# EAGLE design G8MainA (99,5x31) (EAGLE 9.0.0)

## Sheet 1 of 2
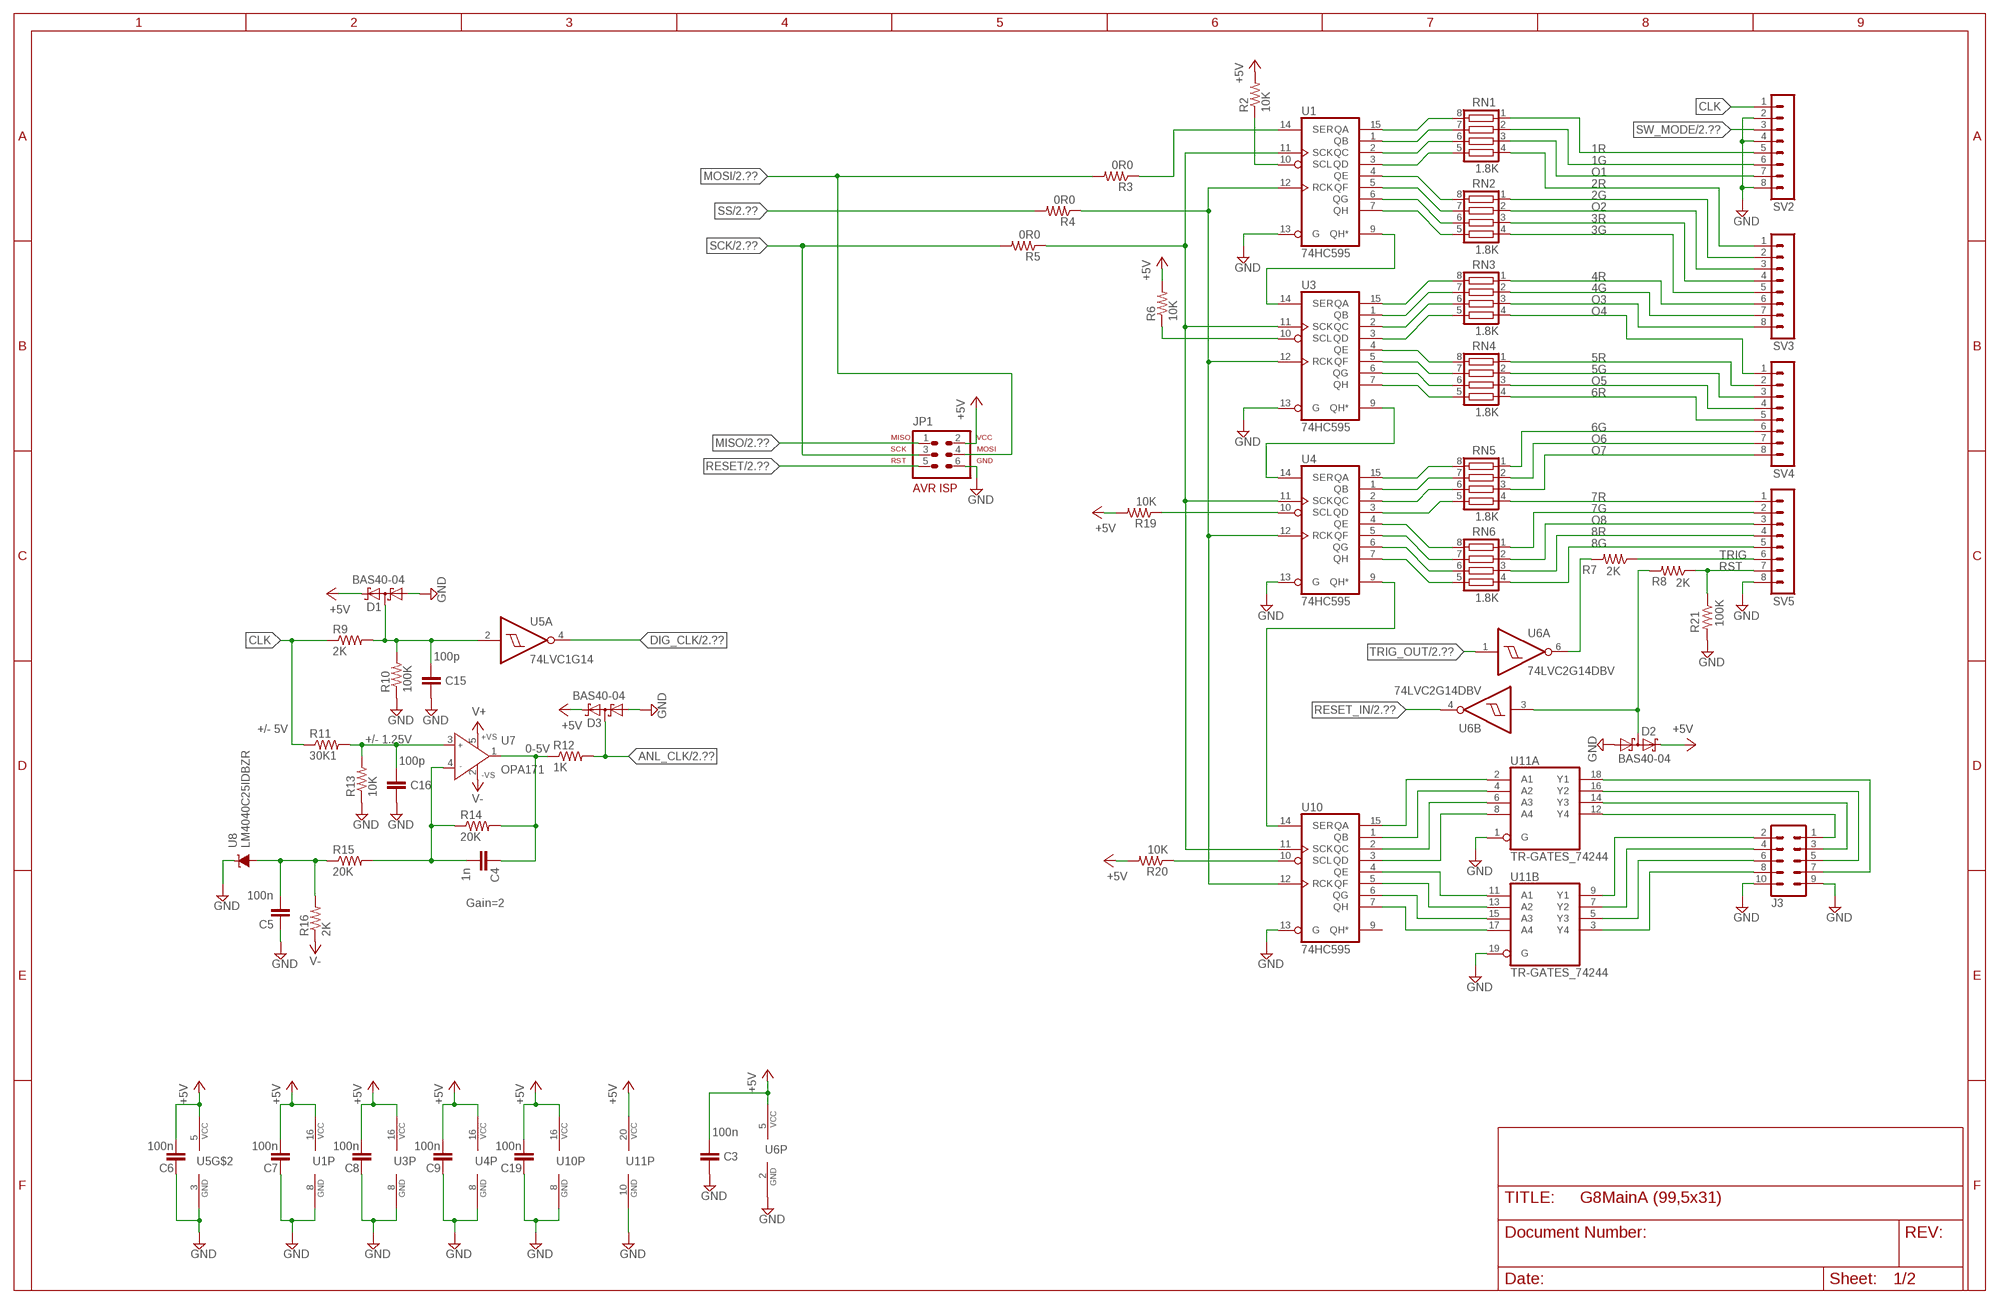
[diagram p0: schematic, sheet 1]

### Parts
C3  100n  C0603  [C0603]
C4  1n  C0603  [C0603]
C5  100n  C0603  [C0603]
C6  100n  C0603  [C0603]
C7  100n  C0603  [C0603]
C8  100n  C0603  [C0603]
C9  100n  C0603  [C0603]
C15  100p  C0603  [C0603]
C16  100p  C0603  [C0603]
C19  100n  C0603  [C0603]
D1  BAS40-04  [SOT23]
D2  BAS40-04  [SOT23]
D3  BAS40-04  [SOT23]
J3  MA05-2  [MA05-2]
JP1  AVR-ISP-6VERT  [AVR-ISP-6]
R2  10K  R0603  [R0603]
R3  0R0  R0603  [R0603]
R4  0R0  R0603  [R0603]
R5  0R0  R0603  [R0603]
R6  10K  R0603  [R0603]
R7  2K  R0603  [R0603]
R8  2K  R0603  [R0603]
R9  2K  R0603  [R0603]
R10  100K  R0603  [R0603]
R11  30K1  R0603  [R0603]
R12  1K  R0603  [R0603]
R13  10K  R0603  [R0603]
R14  20K  R0603  [R0603]
R15  20K  R0603  [R0603]
R16  2K  R0603  [R0603]
R19  10K  R0603  [R0603]
R20  10K  R0603  [R0603]
R21  100K  R0603  [R0603]
RN1  1.8K  CTS742C083  [CTS742C083]
RN2  1.8K  CTS742C083  [CTS742C083]
RN3  1.8K  CTS742C083  [CTS742C083]
RN4  1.8K  CTS742C083  [CTS742C083]
RN5  1.8K  CTS742C083  [CTS742C083]
RN6  1.8K  CTS742C083  [CTS742C083]
SV2  MA08-1-O  [MA08-OCT]
SV3  MA08-1-O  [MA08-OCT]
SV4  MA08-1-O  [MA08-OCT]
SV5  MA08-1-O  [MA08-OCT]
U1  74HC595  74595DT  [TSSOP16]
U3  74HC595  74595DT  [TSSOP16]
U4  74HC595  74595DT  [TSSOP16]
U5  74LVC1G14  [SOT23-5L]
U6  74LVC2G14DBV  [SOT23-6]
U7  OPA171  AD8031RJ  [SOT23-5]
U8  LM4040C25IDBZR  LM4041A12DBZ  [DBZ_R-PDSO-G3]
U10  74HC595  74595DT  [TSSOP16]
U11  TR-GATES_74244  [TR-GATES_TSSOP20]

### Nets
+5V: C3.2 C6.2 C7.2 C8.2 C9.2 C19.2 D1.2(C2) D2.2(C2) D3.2(C2) JP1.2 R2.2 R6.2 R19.2 R20.2 U1.16(VCC) U3.16(VCC) U4.16(VCC) U5.5(VCC) U6.5(P:VCC) U10.16(VCC) U11.20(P:VCC) ; also sheet 2
ANL_CLK: D3.3(C1A2) R12.2 ; also sheet 2
CLK: R9.1 R11.1 SV2.1
DIG_CLK: U5.4(A:O) ; also sheet 2
GND: C3.1 C5.1 C6.1 C7.1 C8.1 C9.1 C15.1 C16.1 C19.1 D1.1(A1) D2.1(A1) D3.1(A1) J3.9 J3.10 JP1.6 R10.1 R13.1 R21.2 SV2.2 SV2.4 SV2.8 SV5.8 U1.8(GND) U1.13(G) U3.8(GND) U3.13(G) U4.8(GND) U4.13(G) U5.3(GND) U6.2(P:GND) U8.1(C) U10.8(GND) U10.13(G) U11.1(A:G) U11.10(P:GND) U11.19(B:G) ; also sheet 2
MISO: JP1.1 ; also sheet 2
MOSI: JP1.4 R3.2 ; also sheet 2
N$1: U1.9(QH*) U3.14(SER)
N$2: C15.2 D1.3(C1A2) R9.2 R10.2 U5.2(A:I)
N$3: C16.2 R11.2 R13.2 U7.3(IN+)
N$4: C4.2 R14.1 R15.2 U7.4(IN-)
N$5: U3.9(QH*) U4.14(SER)
N$7: R5.1 U1.11(SCK) U3.11(SCK) U4.11(SCK) U10.11(SCK)
N$8: R4.1 U1.12(RCK) U3.12(RCK) U4.12(RCK) U10.12(RCK)
N$9: R6.1 U3.10(SCL)
N$12: RN3.8 U3.15(QA)
N$13: RN2.8 U1.4(QE)
N$14: RN2.7 U1.5(QF)
N$15: RN2.6 U1.6(QG)
N$16: RN2.5 U1.7(QH)
N$17: RN1.5 U1.3(QD)
N$18: RN1.6 U1.2(QC)
N$19: C4.1 R12.1 R14.2 U7.1(OUT)
N$20: RN1.7 U1.1(QB)
N$21: RN1.8 U1.15(QA)
N$22: R3.1 U1.14(SER)
N$25: RN3.7 U3.1(QB)
N$26: RN3.6 U3.2(QC)
N$27: RN3.5 U3.3(QD)
N$28: RN4.8 U3.4(QE)
N$29: RN4.7 U3.5(QF)
N$30: RN4.6 U3.6(QG)
N$31: RN4.5 U3.7(QH)
N$32: RN5.8 U4.15(QA)
N$33: RN5.7 U4.1(QB)
N$34: RN5.6 U4.2(QC)
N$35: RN5.5 U4.3(QD)
N$36: RN6.8 U4.4(QE)
N$37: RN6.7 U4.5(QF)
N$38: RN6.6 U4.6(QG)
N$39: RN6.5 U4.7(QH)
N$40: RN1.1 SV2.5
N$41: RN1.2 SV2.6
N$42: RN1.3 SV2.7
N$43: RN1.4 SV3.1
N$44: RN2.1 SV3.2
N$45: RN2.2 SV3.3
N$46: RN2.3 SV3.4
N$47: RN2.4 SV3.5
N$48: RN3.1 SV3.6
N$49: RN3.2 SV3.7
N$50: RN3.3 SV3.8
N$51: RN3.4 SV4.1
N$52: RN4.1 SV4.2
N$53: RN4.2 SV4.3
N$54: RN4.3 SV4.4
N$55: RN4.4 SV4.5
N$56: RN5.1 SV4.6
N$57: RN5.2 SV4.7
N$58: RN5.3 SV4.8
N$59: RN5.4 SV5.1
N$60: RN6.1 SV5.2
N$61: RN6.2 SV5.3
N$62: RN6.3 SV5.4
N$63: RN6.4 SV5.5
N$68: R19.1 U4.10(SCL)
N$69: R2.1 U1.10(SCL)
N$70: C5.2 R15.1 R16.2 U8.2(A)
N$72: R8.1 R21.1 SV5.7
N$73: R7.1 SV5.6
N$74: R7.2 U6.6(A:O)
N$76: D2.3(C1A2) R8.2 U6.3(B:I)
N$77: U4.9(QH*) U10.14(SER)
N$78: R20.1 U10.10(SCL)
N$79: J3.7 U11.18(A:Y1)
N$80: U10.15(QA) U11.2(A:A1)
N$81: U10.1(QB) U11.4(A:A2)
N$82: U10.2(QC) U11.6(A:A3)
N$83: U10.3(QD) U11.8(A:A4)
N$84: U10.4(QE) U11.11(B:A1)
N$85: U10.5(QF) U11.13(B:A2)
N$86: U10.6(QG) U11.15(B:A3)
N$87: U10.7(QH) U11.17(B:A4)
N$88: J3.5 U11.16(A:Y2)
N$89: J3.3 U11.14(A:Y3)
N$90: J3.1 U11.12(A:Y4)
N$91: J3.2 U11.9(B:Y1)
N$92: J3.4 U11.7(B:Y2)
N$93: J3.6 U11.5(B:Y3)
N$94: J3.8 U11.3(B:Y4)
RESET: JP1.5 ; also sheet 2
RESET_IN: U6.4(B:O) ; also sheet 2
SCK: JP1.3 R5.2 ; also sheet 2
SS: R4.2 ; also sheet 2
SW_MODE: SV2.3 ; also sheet 2
TRIG_OUT: U6.1(A:I) ; also sheet 2
V+: U7.5(+VS) ; also sheet 2
V-: R16.1 U7.2(-VS) ; also sheet 2
Unconnected: U10.9(QH*)

### Notes on the sheet
- 1R
- 1G
- O1
- 2R
- 2G
- O2
- 3R
- 3G
- 4R
- 4G
- O3
- O4
- 5R
- 5G
- O5
- 6R
- 6G
- O6
- O7
- 7R
- 7G
- O8
- 8R
- 8G
- TRIG
- RST
- +/- 5V
- +/- 1.25V
- 0-5V
- Gain=2

## Sheet 2 of 2
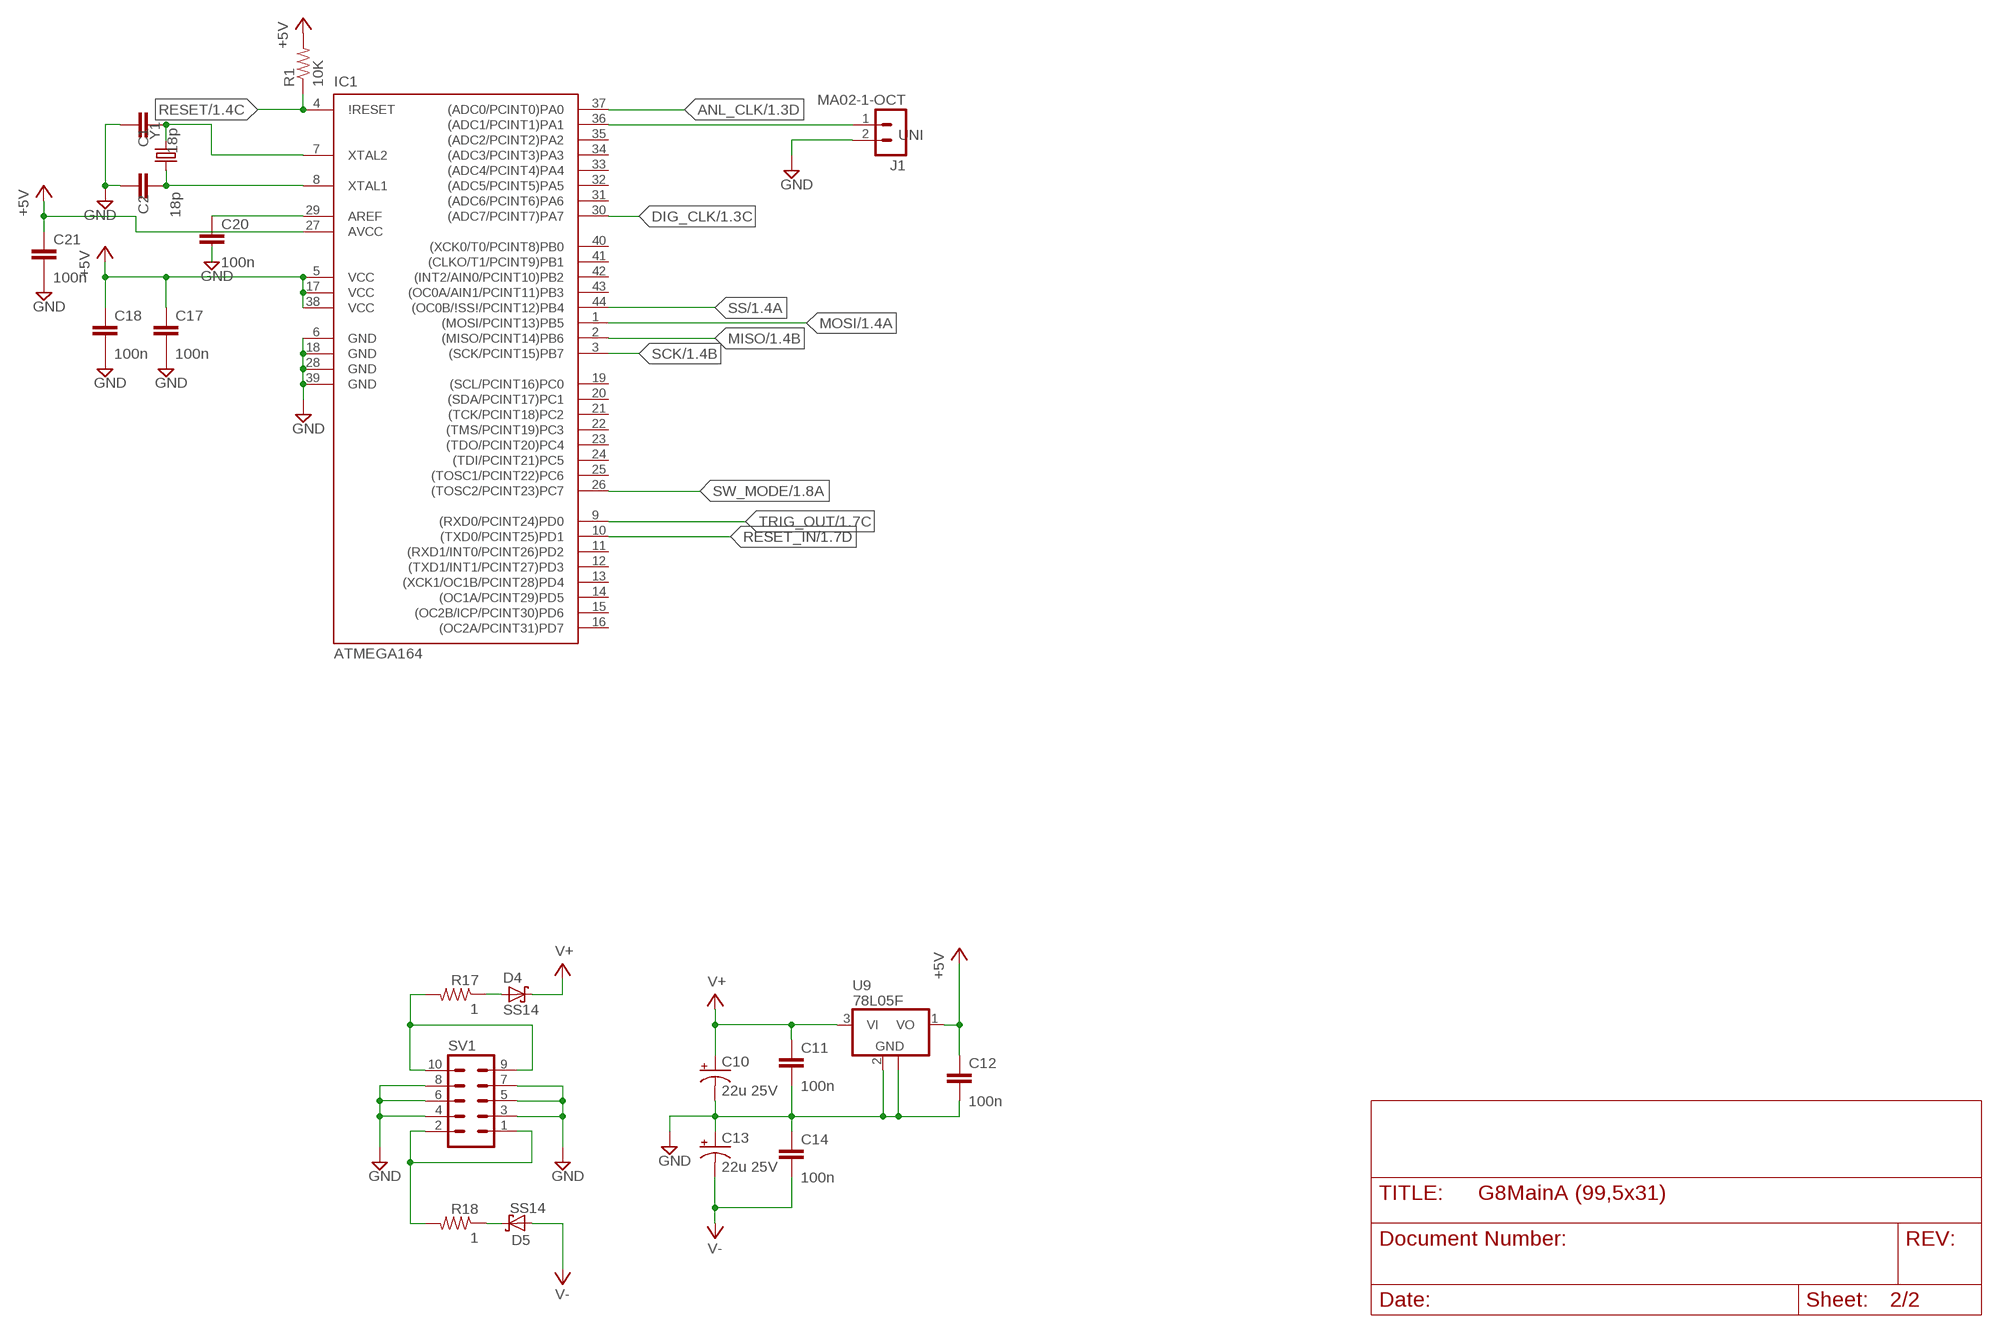
[diagram p1: schematic, sheet 2]

### Parts
C1  18p  C0603  [C0603]
C2  18p  C0603  [C0603]
C10  22u 25V  CPOL-USC  [PANASONIC_C]
C11  100n  C0603  [C0603]
C12  100n  C0603  [C0603]
C13  22u 25V  CPOL-USC  [PANASONIC_C]
C14  100n  C0603  [C0603]
C17  100n  C0603  [C0603]
C18  100n  C0603  [C0603]
C20  100n  C0603  [C0603]
C21  100n  C0603  [C0603]
D4  SS14  T100331  [SMA-DO214AC]
D5  SS14  T100331  [SMA-DO214AC]
IC1  ATMEGA164  MEGA164P/324P/644P-AU  [TQFP44]
J1  MA02-1-OCT  [MA02-1-OCT]
R1  10K  R0603  [R0603]
R17  1  R0603  [R0603]
R18  1  R0603  [R0603]
SV1  MA05-2  [MA05-2]
U9  78L05F  [SOT89]
Y1  CRYSTALHC49UV  [HC49U-V]

### Nets
+5V: C12.1 C17.1 C18.1 C21.1 IC1.5(VCC) IC1.17(VCC) IC1.27(AVCC) IC1.38(VCC) R1.2 U9.1(VO) ; also sheet 1
ANL_CLK: IC1.37((ADC0/PCINT0)PA0) ; also sheet 1
DIG_CLK: IC1.30((ADC7/PCINT7)PA7) ; also sheet 1
GND: C1.1 C2.1 C10.- C11.2 C12.2 C13.+ C14.1 C17.2 C18.2 C20.2 C21.2 IC1.6(GND) IC1.18(GND) IC1.28(GND) IC1.39(GND) J1.2 SV1.3 SV1.4 SV1.5 SV1.6 SV1.7 SV1.8 U9.2(GND) U9.2@1(GND) ; also sheet 1
MISO: IC1.2((MISO/PCINT14)PB6) ; also sheet 1
MOSI: IC1.1((MOSI/PCINT13)PB5) ; also sheet 1
N$6: C20.1 IC1.29(AREF)
N$10: C2.2 IC1.8(XTAL1) Y1.1
N$11: C1.2 IC1.7(XTAL2) Y1.2
N$24: IC1.36((ADC1/PCINT1)PA1) J1.1
N$64: R18.2 SV1.1 SV1.2
N$65: D4.A R17.1
N$66: R17.2 SV1.9 SV1.10
N$67: D5.K(C) R18.1
RESET: IC1.4(\!RESET) R1.1 ; also sheet 1
RESET_IN: IC1.10((TXD0/PCINT25)PD1) ; also sheet 1
SCK: IC1.3((SCK/PCINT15)PB7) ; also sheet 1
SS: IC1.44((OC0B/\!SS\!/PCINT12)PB4) ; also sheet 1
SW_MODE: IC1.26((TOSC2/PCINT23)PC7) ; also sheet 1
TRIG_OUT: IC1.9((RXD0/PCINT24)PD0) ; also sheet 1
V+: C10.+ C11.1 D4.K(C) U9.3(VI) ; also sheet 1
V-: C13.- C14.2 D5.A ; also sheet 1
Unconnected: IC1.11((RXD1/INT0/PCINT26)PD2) IC1.12((TXD1/INT1/PCINT27)PD3) IC1.13((XCK1/OC1B/PCINT28)PD4) IC1.14((OC1A/PCINT29)PD5) IC1.15((OC2B/ICP/PCINT30)PD6) IC1.16((OC2A/PCINT31)PD7) IC1.19((SCL/PCINT16)PC0) IC1.20((SDA/PCINT17)PC1) IC1.21((TCK/PCINT18)PC2) IC1.22((TMS/PCINT19)PC3) IC1.23((TDO/PCINT20)PC4) IC1.24((TDI/PCINT21)PC5) IC1.25((TOSC1/PCINT22)PC6) IC1.31((ADC6/PCINT6)PA6) IC1.32((ADC5/PCINT5)PA5) IC1.33((ADC4/PCINT4)PA4) IC1.34((ADC3/PCINT3)PA3) IC1.35((ADC2/PCINT2)PA2) IC1.40((XCK0/T0/PCINT8)PB0) IC1.41((CLKO/T1/PCINT9)PB1) IC1.42((INT2/AIN0/PCINT10)PB2) IC1.43((OC0A/AIN1/PCINT11)PB3)

### Notes on the sheet
- UNI

## Library data of the parts
C1-C9 C11 C12 C14-C21 = tr-passives:C0603
C10 C13 = rcl:CPOL-US: POLARIZED CAPACITOR, American symbol; DK: PCE3900CT-ND; SPICEPREFIX: C
D1-D3 = diode:BAS40-04: Silicon Schottky Diodes General-purpose diode for high-speed switching
D4 D5 = CA Diodes:T100331: SS14 Schottky diode; CA: T100331
IC1 = avr-5-4.16:MEGA164P/324P/644P-AU
J1 = tr-con:MA02-1
J3 SV1 = tr-con:MA05-2: PIN HEADER
JP1 = avr-7:AVR-ISP-6: AVR ISP-6 Serial Programming Header
R1-R21 = tr-passives:R0603
RN1-RN6 = resistor-net:CTS742C083: Chip Resistor Array 4 Single Resistor Source: http://www.ctscorp.com/components/Datasheets/CTSChipArrayDs.pdf; OC_FARNELL: unknown; OC_NEWARK: unknown
SV2-SV5 = tr-con:MA08-1: PIN HEADER
U1 U3 U4 U10 = tr-gates:74*595: 8-bit SHIFT REGISTER, output latch
U5 = tr-gates:74LVC1G14
U6 = tr-gates:74LVC2G14
U7 = analog-devices:AD8031: 2.7 V, 800 ?A, 80 MHz Rail-to-Rail I/O Amplifiers Source: http://www.analog.com/static/imported-files/data_sheets/AD8031_8032.pdf; MPN: AD8031ARTZ-REEL7; OC_FARNELL: 1660972; OC_NEWARK: 84R8399
U8 = texas:LM4041: PRECISION MICROPOWER SHUNT VOLTAGE REFERENCE Source: http://focus.ti.com/lit/ds/slcs146e/slcs146e.pdf; MPN: LM4041A12IDBZR; OC_FARNELL: 1407949; OC_NEWARK: 58K5875
U9 = tr-ps:78L*: POSITOIV-VOLTAGE REGULATORS Output up to 100 mA Source: http://focus.ti.com/lit/ds/symlink/ua78l05.pdf
U11 = !74LS244:TR-GATES_74*244: Octal BUFFER and LINE DRIVER, 3-state
Y1 = SparkFun-FreqCtrl:CRYSTAL: Various standard crystals. Proven footprints. Spark Fun Electronics SKU : COM-00534

## Board
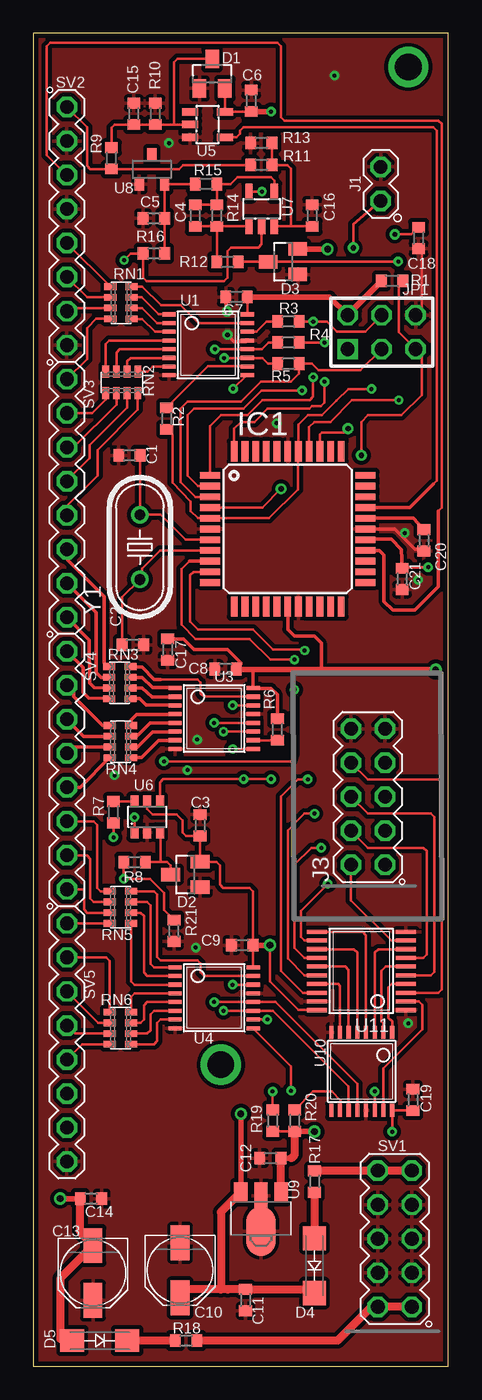
[diagram p2: board, top side]
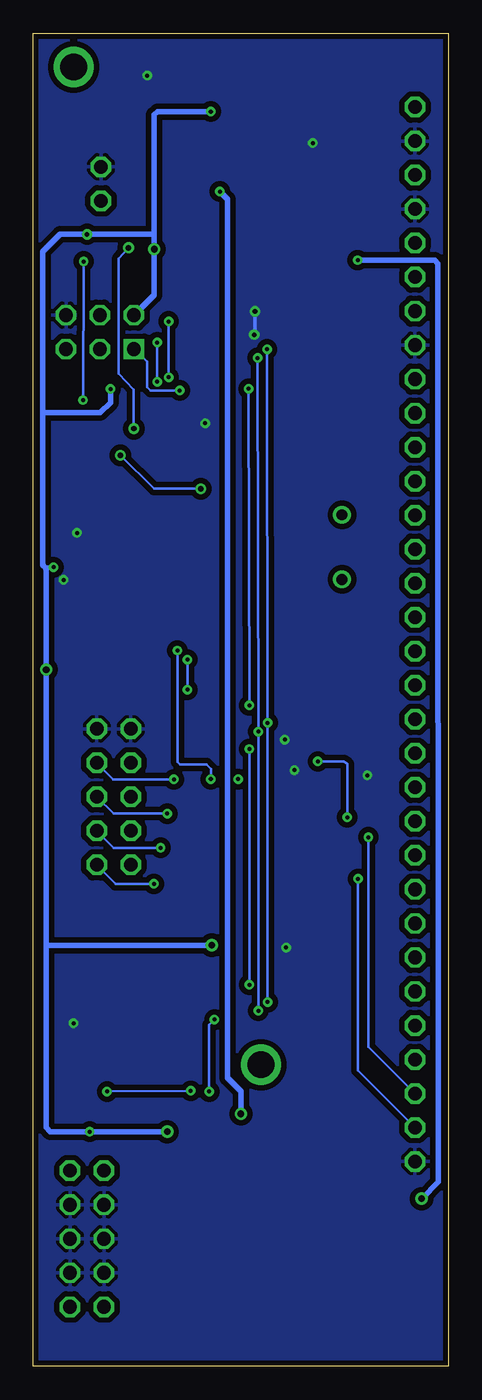
[diagram p3: board, bottom side, seen from below]

Size 31 x 99.5 mm. Coordinates in mm from the lower left corner, seen from the top.
Outline: 0,0 31,0 31,99.5 0,99.5 0,0
Copper layers (1*16): Top 0.035mm / dielectric 1.5mm / Bottom 0.035mm
Design rules "default *": minimum track width 6mil, minimum drill 0.3mm, track to track 6mil, track to pad 6mil, pad to pad 6mil, via to via 6mil, smd to smd 6mil, copper to edge 15mil, drill to drill 6mil, minimum pad ring 10mil, minimum via ring 8mil, stop-mask expansion 4mil, vias tented up to drill 0mil, thermal gap 10mil

### Footprints (pad centres in the part's own frame; a part is rotated, then mirrored left to right if it is on the bottom)
C0603 = smd 0.8 x 0.95: 1 -0.8,0; 2 0.8,0
PANASONIC_C = smd 2.6 x 1.4: + 2.05,0; - -2.05,0
SOT23 = smd 1 x 1.4: 1 -0.95,-1.1; 2 0.95,-1.1; 3 0,1.1
SMA-DO214AC = smd 1.8 x 1.7: A -2.05,0; K 2.05,0
TQFP44 = smd 1.5 x 0.5: 1 -5.8,4; 2 -5.8,3.2; 3 -5.8,2.4; 4 -5.8,1.6; 5 -5.8,0.8; 6 -5.8,0; 7 -5.8,-0.8; 8 -5.8,-1.6; 9 -5.8,-2.4; 10 -5.8,-3.2; 11 -5.8,-4; 23 5.8,-4; 24 5.8,-3.2; 25 5.8,-2.4; 26 5.8,-1.6; 27 5.8,-0.8; 28 5.8,0; 29 5.8,0.8; 30 5.8,1.6; 31 5.8,2.4; 32 5.8,3.2; 33 5.8,4 | smd 0.5 x 1.5: 12 -4,-5.8; 13 -3.2,-5.8; 14 -2.4,-5.8; 15 -1.6,-5.8; 16 -0.8,-5.8; 17 0,-5.8; 18 0.8,-5.8; 19 1.6,-5.8; 20 2.4,-5.8; 21 3.2,-5.8; 22 4,-5.8; 34 4,5.8; 35 3.2,5.8; 36 2.4,5.8; 37 1.6,5.8; 38 0.8,5.8; 39 0,5.8; 40 -0.8,5.8; 41 -1.6,5.8; 42 -2.4,5.8; 43 -3.2,5.8; 44 -4,5.8
MA02-1-OCT = drill 1.016 octagon: 1 -1.27,0; 2 1.27,0
MA05-2 = drill 1.016 octagon: 1 -5.08,-1.27; 2 -5.08,1.27; 3 -2.54,-1.27; 4 -2.54,1.27; 5 0,-1.27; 6 0,1.27; 7 2.54,-1.27; 8 2.54,1.27; 9 5.08,-1.27; 10 5.08,1.27
AVR-ISP-6 = drill 1.016 square: 1 -2.54,-1.27 | drill 1.016 octagon: 2 -2.54,1.27; 3 0,-1.27; 4 0,1.27; 5 2.54,-1.27; 6 2.54,1.27
R0603 = smd 0.8 x 0.95: 1 -0.8,0; 2 0.8,0
CTS742C083 = smd 0.5 x 0.9: 1 -1.2,-0.8; 2 -0.4,-0.8; 3 0.4,-0.8; 4 1.2,-0.8; 5 1.2,0.8; 6 0.4,0.8; 7 -0.4,0.8; 8 -1.2,0.8
MA08-OCT = drill 1.016 octagon: 1 -8.89,0; 2 -6.35,0; 3 -3.81,0; 4 -1.27,0; 5 1.27,0; 6 3.81,0; 7 6.35,0; 8 8.89,0
TSSOP16 = smd 0.305 x 0.991: 1 -2.275,-2.918; 2 -1.625,-2.918; 3 -0.975,-2.918; 4 -0.325,-2.918; 5 0.325,-2.918; 6 0.975,-2.918; 7 1.625,-2.918; 8 2.275,-2.918; 9 2.275,2.918; 10 1.625,2.918; 11 0.975,2.918; 12 0.325,2.918; 13 -0.325,2.918; 14 -0.975,2.918; 15 -1.625,2.918; 16 -2.275,2.918
SOT23-5L = smd 0.55 x 1.2: 1 -0.95,-1.3; 2 0,-1.3; 3 0.95,-1.3; 4 0.95,1.3; 5 -0.95,1.3
SOT23-6 = smd 0.6 x 0.9: 1 -0.95,-1.15; 2 0,-1.15; 3 0.95,-1.15; 4 0.95,1.15; 5 0,1.15; 6 -0.95,1.15
SOT23-5 = smd 0.55 x 1.2: 1 -0.95,-1.3; 2 0,-1.3; 3 0.95,-1.3; 4 0.95,1.3; 5 -0.95,1.3
DBZ_R-PDSO-G3 = smd 0.7 x 1: 1 -0.95,-1.1; 2 0.95,-1.1; 3 0,1.1
SOT89 = smd 1 x 1.5: 1 -1.499,-1.981; 3 1.499,-1.981 | smd 1 x 2: 2 0,-1.727 | smd 2.2 x 3.7: 2@1 0,0.94
TR-GATES_TSSOP20 = smd 0.305 x 1.499: 1 -2.925,-3.327; 2 -2.275,-3.327; 3 -1.625,-3.327; 4 -0.975,-3.327; 5 -0.325,-3.327; 6 0.325,-3.327; 7 0.975,-3.327; 8 1.625,-3.327; 9 2.275,-3.327; 10 2.925,-3.327; 11 2.925,3.327; 12 2.275,3.327; 13 1.625,3.327; 14 0.975,3.327; 15 0.325,3.327; 16 -0.325,3.327; 17 -0.975,3.327; 18 -1.625,3.327; 19 -2.275,3.327; 20 -2.925,3.327
HC49U-V = drill 0.813: 1 -2.413,0; 2 2.413,0

### Placement (x,y rotation side)
C1  7.17,68 0 top
C2  7.42,53.85 180 top
C3  12.45,40.38 270 top
C4  12.1,85.9 90 top
C5  9,85.7 0 top
C6  16.27,94.47 270 top
C7  15.18,79.83 0 top
C8  14.35,52.05 0 top
C9  15.6,31.42 0 top
C10  10.95,7.15 270 top
C11  15.85,4.93 270 top
C12  17.7,15.52 180 top
C13  4.45,6.95 270 top
C14  4.3,12.5 180 top
C15  7.5,93.5 270 top
C16  20.82,85.9 270 top
C17  10.03,53.5 270 top
C18  28.77,84.22 270 top
C19  28.35,19.88 270 top
C20  29.18,61.65 270 top
C21  27.55,58.78 270 top
D1  13.35,96.5 0 top
D2  11.35,36.7 90 top
D3  18.65,82.45 90 top
D4  21,7.5 270 top
D5  4.95,1.9 0 top
IC1  19,62.5 0 top
J1  25.95,88.28 90 top
J3  25,42.5 90 top
JP1  26.02,77.2 0 top
R1  26.8,81.03 180 top
R2  9.95,70.75 270 top
R3  19.05,78 0 top
R4  19.05,76.42 0 top
R5  19.05,74.85 0 top
R6  18.23,47.52 90 top
R7  5.97,41.35 90 top
R8  7.55,37.62 0 top
R9  5.83,90.17 90 top
R10  9.1,93.5 270 top
R11  17.02,89.67 0 top
R12  14.5,82.45 0 top
R13  17.02,91.33 0 top
R14  13.7,85.9 270 top
R15  12.9,88.25 0 top
R16  9,83.08 0 top
R17  21,13.77 90 top
R18  11.4,1.9 0 top
R19  17.88,18.32 270 top
R20  19.52,18.32 270 top
R21  10.5,32.5 270 top
RN1  6.55,79.4 270 top
RN2  6.6,73.45 0 top
RN3  6.45,51.02 270 top
RN4  6.5,46.62 270 top
RN5  6.5,34.25 270 top
RN6  6.5,25.23 270 top
SV1  27,9.5 90 top
SV2  2.5,85.12 270 top
SV3  2.5,64.8 270 top
SV4  2.5,44.48 270 top
SV5  2.5,24.16 270 top
U1  13.05,76.25 270 top
U3  13.5,48.35 270 top
U4  13.5,27.5 270 top
U5  13,92.7 270 top
U6  8.5,41 0 top
U7  17.05,86.4 0 top
U8  8.85,89.35 0 top
U9  17,11 180 top
U10  24.52,22 180 top
U11  24.5,29.5 90 top
Y1  7.95,61.15 90 top

### Tracks (layer width: path | path; a pad name or v marks a point on that pad's centre or on a via)
+5V  (via drill 0.3, 0.35, 0.5)
  Top 0.203: v26.8,17.5 U10.16 28.34,19.08 C19.2 | 12.3,39.58 C3.2 | C3.2 D2.2 13.67,37.65 13.93,37.4 13.93,35.95 14.18,35.7 16.15,35.7 16.4,35.45 C9.2 16.42,31.42 U4.16 | R20.2 R19.2 | D1.2 U5.5 16.27,93.65 C6.2 | U1.16 C7.2 | 25.2,72.95 v25.25,72.95 23.55,72.95 22.65,72.1 21.55,71 20.5,71 19.8,70.3 IC1.38 19.75,68.25 19.75,65.45 17.6,63.3 IC1.5 12.3,63.3 11.75,63.85 11.75,64.55 10.4,65.95 10.4,69.5 R2.2 | C3.2 11.4,39.58 11.15,39.83 11.15,40.75 10.7,41.2 8.9,41.2 8.5,41.6 U6.5 | C18.1 28.25,84.5 v27,84.5 | v17.68,31.42 17.68,28.71 19.81,26.58 U11.20
  Top 0.254: R6.2 18.23,50.12 17.75,50.6 16.54,50.6 U3.16 16.42,51.92 16.5,52 | IC1.27 24.85,61.75 26.75,61.75 27.5,60.95 C21.1 27.48,59.62 v29.5,59.65 | IC1.17 19,55 19.5,54.5 21,54.5 21.5,54 21.5,52 | C8.2 15.5,52.4 15.5,52.5 14.5,53.5 12,53.5 11.2,54.3 C17.1
  Top 0.406: v30.05,52 21.5,52 16.5,52 15.25,52 C8.2 | U9.1 | C12.1 19.27,15.52 | R20.2 20.98,17.52 v21,17.5 | C9.2 v17.68,31.42 | C7.2 22.13,79.83 JP1.2 23.48,78.51 R1.2 | v21.98,83.4 D3.2 | v17.75,93.67 C6.2
  Top 0.61: U9.1 C12.1 | 19.27,15.52 19.52,15.78 R20.2
  Bottom 0.254: v29.5,59.65 30.15,59.65 30.25,59.75
  Bottom 0.406: v21,17.5 v26.8,17.5 29.75,17.5 30.05,17.8 30.05,31.42 | 30.05,31.42 v30.05,52 30.05,59.5 30.25,59.75 30.3,59.8 30.3,71.2 | 30.3,71.2 30.3,83.2 29,84.5 v27,84.5 21.98,84.5 | v17.68,31.42 30.05,31.42 | 21.98,84.5 v21.98,83.4 22,83.38 22,79.95 JP1.2 | 21.98,84.5 21.98,93.42 21.72,93.67 v17.75,93.67 | 30.3,71.2 26,71.2 25.25,71.95 v25.25,72.95
ANL_CLK  (via drill 0.3)
  Top 0.203: R12.2 D3.3 27.25,82.45 v27.25,82.47 | v27.3,72.12 23.8,72.12 22.18,70.5 21,70.5 20.6,70.1 IC1.37
  Bottom 0.203: v27.3,72.12 v27.25,82.47
CLK
  Top 0.203: R11.1 11.18,89.67 10.88,89.38 R9.1 4.25,89.38 4,89.63 4,92.51 SV2.1
DIG_CLK
  Top 0.203: U5.4 15.17,91.75 15.43,92 15.43,92.25 15.68,92.5 29.87,92.5 30.12,92.25 30.12,66.1 29.87,65.85
  Top 0.254: IC1.30 28.12,64.1 29.87,65.85
GND  (via drill 0.3, 0.35)
  Top 0.203: C18.2 29,83.2 29,79 28.57,78.56 JP1.6
  Top 0.254: IC1.28 27,62.5 28.5,61 29.02,61 C20.2 | U1.13 15.89,76.5 15,76.5 v14.5,77 | v14.45,78.75 14.38,78.83 C7.1
  Bottom 0.254: v14.5,77 14.45,77.05 v14.45,78.75
  other vias: 28.75,58.7 11.5,44.5 6.05,44.1 18.18,70.4 28,25.6 22.5,96.35 10.12,91.33 12.22,46.77 12.12,31.25 27.75,62.2
  pour Top (isolate 0.29): -9.5,-3 32,-3.5 32.5,100 -9,100.5
  pour Bottom (isolate 0.406): -2.5,-2 38,-1.5 38.5,100 -2.5,100.5
MISO  (via drill 0.3)
  Top 0.203: IC1.2 12.3,65.7 11.5,66.5 11.5,71 12,71.5 15.7,71.5 17.05,72.85 v20.07,72.85
  Bottom 0.203: v20.07,72.85 22.25,72.85 22.5,73.1 22.5,75 JP1.1
MOSI  (via drill 0.3)
  Top 0.203: R3.2 v20.9,78 21.93,78 22.68,77.25 24.8,77.25 JP1.4 | v20.9,73.83 20.9,72.38 20.65,72.12 17.12,72.12 16,71 14,71 13.2,70.2 IC1.1
  Bottom 0.203: v20.9,73.83 v20.9,78
N$1  (via drill 0.3)
  Top 0.203: U1.9 v14.93,72.97 | v14.88,49.33 U3.14
  Bottom 0.203: v14.93,72.97 v14.88,49.33
N$2
  Top 0.203: D1.3 10.75,97.6 10.5,97.35 10.5,92.7 | 10.5,92.7 U5.2 | 10.5,92.7 R10.2 C15.2 6.08,92.7 5.83,92.45 R9.2
N$3
  Top 0.203: U7.3 19.25,85.1 | 19.25,85.1 C16.2 | R13.2 R11.2 19,89.67 19.25,89.42 19.25,85.1
N$4
  Top 0.203: C4.2 R14.1 R15.2 14.72,88.25 15.25,88.78 17.75,88.78 18,88.52 U7.4
N$5  (via drill 0.3)
  Top 0.203: U3.9 v14.88,46.08 | v14.88,28.48 U4.14
  Bottom 0.203: v14.88,46.08 v14.88,28.48
N$6
  Top 0.254: C20.1 28.4,63.3 IC1.29
N$7  (via drill 0.3)
  Top 0.203: R5.1 17.52,74.85 17.1,75.28 U1.11 v14.25,75.28 | v14.2,47.38 U3.11 | v14.2,26.52 U4.11 17.91,26.52 23.55,20.88 U10.11
  Bottom 0.203: v14.25,75.28 v14.2,47.38 v14.2,26.52
N$8  (via drill 0.3)
  Top 0.203: R4.1 17.57,76.42 17.07,75.92 U1.12 v13.55,75.92 | v13.5,48.02 U3.12 | v13.5,27.17 U4.12 18.08,27.17 24.2,21.05 U10.12
  Bottom 0.203: v13.55,75.92 v13.5,48.02 v13.5,27.17
N$9
  Top 0.203: U3.10 R6.1
N$10
  Top 0.203: IC1.8 9.45,60.9 8.1,59.55 8.1,58.89 Y1.1 6.62,57.41 C2.2
N$11
  Top 0.203: C1.2 7.97,63.59 Y1.2 9.49,63.56 11.35,61.7 IC1.7
N$12
  Top 0.203: 9.5,51.27 12.25,51.27 12.5,51.02 12.5,50.23 12.75,49.98 U3.15
  Top 0.254: 9.5,51.27 9.03,51.27 8.1,52.2 7.28,52.2 RN3.8
N$13
  Top 0.203: U1.4 5.65,76.58 5.4,76.32 RN2.8
N$14
  Top 0.203: U1.5 6.45,75.92 6.2,75.67 RN2.7
N$15
  Top 0.203: U1.6 7.25,75.28 7,75.02 RN2.6
N$16
  Top 0.203: U1.7 8.9,74.62 8.53,74.25 RN2.5
N$17
  Top 0.203: U1.3 9.07,77.22 8.12,78.17 7.38,78.17 RN1.5
N$18
  Top 0.203: U1.2 9.22,77.88 8.1,79 RN1.6
N$19
  Top 0.203: R14.2 R12.1 | C4.1 R14.2 | R14.2 U7.1
N$20
  Top 0.203: U1.1 9.35,78.53 8.07,79.8 RN1.7
N$21
  Top 0.203: RN1.8 8.12,80.6 9.53,79.2 11,79.2 12.32,77.88 U1.15
N$22
  Top 0.203: U1.14 16.65,77.22 17.43,78 R3.1
N$23  (via drill 2)
  other vias: 14,22.5
N$24  (via drill 0.4)
  Top 0.203: IC1.36 21.4,69.55 21.55,69.7 23.2,69.7 v23.5,70 | v23.9,83.5 23.9,85.25 J1.1
  Bottom 0.203: v23.5,70 23.5,72.9 24.65,74.1 24.65,82.7 v23.9,83.5
N$25
  Top 0.254: RN3.7 8.12,51.42 8.9,50.65 10.56,50.65 U3.1
N$26
  Top 0.254: RN3.6 8.12,50.62 8.85,49.95 10.51,49.95 U3.2
N$27
  Top 0.254: RN3.5 7.93,49.83 8.4,49.35 10.56,49.35 U3.3
N$28
  Top 0.254: RN4.8 7.3,48.25 7.7,48.65 10.56,48.65 U3.4
N$29
  Top 0.254: RN4.7 7.72,47.02 8.7,48 10.56,48 U3.5
N$30
  Top 0.254: RN4.6 7.78,46.23 8.9,47.35 10.56,47.35 U3.6
N$31
  Top 0.254: RN4.5 8.07,45.42 9.35,46.7 10.56,46.7 U3.7
N$32
  Top 0.203: RN5.8 9,35.45 9.25,35.2 9.25,30.55 9.5,30.3 12.25,30.3 12.5,30.05 12.5,29.38 12.75,29.12 U4.15
N$33
  Top 0.203: U4.1 9,29.77 8.75,30.03 8.75,34.4 8.5,34.65 RN5.7
N$34
  Top 0.203: U4.2 8.5,29.12 8.25,29.38 8.25,33.6 8,33.85 RN5.6
N$35
  Top 0.203: U4.3 7.55,28.48 7.3,28.73 RN5.5
N$36
  Top 0.203: U4.4 7.55,27.83 7.3,27.57 RN6.8
N$37
  Top 0.203: U4.5 8.5,27.17 8.25,26.92 8.25,25.88 8,25.62 RN6.7
N$38
  Top 0.203: U4.6 9,26.52 8.75,26.27 8.75,25.08 8.5,24.83 RN6.6
N$39
  Top 0.203: U4.7 9.5,25.88 9.25,25.62 9.25,24.28 9,24.02 RN6.5
N$40
  Top 0.203: RN1.1 SV2.5
N$41
  Top 0.203: RN1.2 4.01,79.8 SV2.6
N$42
  Top 0.203: RN1.3 2.73,79 SV2.7
N$43
  Top 0.203: RN1.4 4.7,78.2 4,77.5 4,75.19 SV3.1
N$44
  Top 0.203: RN2.1 5.4,72.15 4.4,71.15 SV3.2
N$45
  Top 0.203: SV3.3 3.01,68.61 6.2,71.8 RN2.2
N$46
  Top 0.203: SV3.4 2.5,66.1 4.2,67.8 4.2,68.75 7,71.55 RN2.3
N$47
  Top 0.203: SV3.5 2.5,64.2 4.8,66.5 4.8,68.4 7.8,71.4 RN2.4
N$48
  Top 0.254: RN3.1 5.58,52.23 5.3,52.5 5.3,57.45 2.55,60.2 2.55,60.94 SV3.6
N$49
  Top 0.254: RN3.2 5.08,51.42 4.7,51.8 4.7,56.25 SV3.7
N$50
  Top 0.254: RN3.3 4.53,50.67 4.2,51 4.15,54.21 SV3.8
N$51
  Top 0.254: RN3.4 4.12,49.88 3.7,50.3 3.7,52.17 SV4.1
N$52
  Top 0.254: RN4.1 5.17,47.83 3,50 3,50.33 SV4.2
N$53
  Top 0.254: RN4.2 3.76,47.02 SV4.3
N$54
  Top 0.254: RN4.3 2.98,46.23 SV4.4
N$55
  Top 0.254: SV4.5 3.48,43.21 RN4.4
N$56
  Top 0.203: SV4.6 4.5,40.67 4.75,40.42 4.75,35.7 5,35.45 RN5.1
N$57
  Top 0.203: RN5.2 4.5,34.65 4.25,34.9 4.25,37.88 4,38.13 SV4.7
N$58
  Top 0.203: RN5.3 4.03,33.85 3.78,34.1 3.78,35.58 2.5,35.58 SV4.8
N$59
  Top 0.203: RN5.4 SV5.1
N$60
  Top 0.203: SV5.2 5.45,30.51 5.7,30.26 RN6.1
N$61
  Top 0.203: RN6.2 4.84,25.62 SV5.3
N$62
  Top 0.203: RN6.3 3.1,24.83 SV5.4
N$63
  Top 0.203: RN6.4 3.63,24.02 SV5.5
N$64
  Top 0.406: SV1.2 25.25,4.42
  Top 0.61: SV1.1 SV1.2 | 25.25,4.42 22.73,1.9 R18.2
N$65
  Top 0.61: R17.1 D4.A
N$66
  Top 0.61: SV1.9 SV1.10 23,14.58 R17.2
N$67
  Top 0.61: R18.1 D5.K
N$68  (via drill 0.3)
  Top 0.203: U4.10 v17.48,25.88 | v17.88,20.5 R19.1
  Bottom 0.203: v17.48,25.88 17.88,25.48 v17.88,20.5
N$69
  Top 0.203: 9.65,71.5 R2.1 13.05,74.65 15.94,74.65 U1.10
N$70
  Top 0.203: R16.2 C5.2 U8.2 R15.1
N$72  (via drill 0.3)
  Top 0.203: R8.1 v6.75,36.38 8.7,36.38 9.75,35.33 9.75,34.05 R21.1
  Bottom 0.203: SV5.7 6.75,22.06 v6.75,36.38
N$73  (via drill 0.3)
  Top 0.203: v5.97,39.48 R7.1
  Bottom 0.203: SV5.6 5.97,23.83 v5.97,39.48
N$74
  Top 0.203: U6.6 R7.2
N$75  (via drill 2)
  other vias: 28,97
N$76
  Top 0.203: R8.2 9.5,37.62 | 9.5,37.62 10,37.62 10.25,37.37 D2.3 | U6.3 9.5,39.85 9.5,37.62
N$77  (via drill 0.3)
  Top 0.203: v25.5,20.5 U10.14 | U4.9 19.25,22.39 v19.25,20.55
  Bottom 0.203: v19.25,20.55 v25.5,20.5
N$78
  Top 0.203: R20.1 20.9,20.5 22.3,20.5 22.95,19.85 22.95,19.13 U10.10
N$79  (via drill 0.3)
  Top 0.203: v20.5,43.8 19.75,43.8 18.5,42.55 18.5,29.5 20.12,27.88 U11.18
  Bottom 0.203: J3.7 25.03,43.8 v20.5,43.8
N$80
  Top 0.203: U10.15 26.15,22.23 29.05,25.12 29.05,26.97 28.8,27.23 U11.2
N$81
  Top 0.203: U10.1 26.8,25.73 26.52,26 26.52,28.27 26.78,28.52 U11.4
N$82
  Top 0.203: U10.2 26.15,25.6 26,25.75 26,29.5 26.32,29.83 U11.6
N$83
  Top 0.203: U10.3 25.5,30.87 25.75,31.12 U11.8
N$84
  Top 0.203: U10.4 24.85,32.17 24.6,32.42 U11.11
N$85
  Top 0.203: U10.5 24.2,30.87 23.95,31.12 U11.13
N$86
  Top 0.203: U10.6 23.55,29.57 23.3,29.83 U11.15
N$87
  Top 0.203: U11.17 22.77,28.52 22.9,28.4 U10.7
N$88  (via drill 0.3)
  Top 0.203: v21,41.25 20.25,41.25 19,40 19,30.43 20.25,29.17 U11.16
  Bottom 0.203: v21,41.25 25.02,41.25 J3.5
N$89  (via drill 0.3)
  Top 0.203: v21.5,38.7 20.75,38.7 19.5,37.45 19.5,31.23 20.25,30.48 U11.14
  Bottom 0.203: v21.5,38.7 25.01,38.7 J3.3
N$90  (via drill 0.3)
  Top 0.203: U11.12 20.25,31.77 20,32.03 20,34 v22,36
  Bottom 0.203: v22,36 24.85,36 J3.1
N$91
  Top 0.203: 27.87,31.84 U11.9 26.73,31.77 23.73,34.77 J3.2
N$92
  Top 0.203: J3.4 24.99,38.7 29.15,38.7 29.4,38.45 29.4,30.73 29.15,30.48 U11.7
N$93
  Top 0.203: J3.6 24.98,41.25 29.7,41.25 29.95,41 29.95,29.43 29.7,29.17 U11.5
N$94
  Top 0.203: J3.8 24.97,43.8 30.25,43.8 30.5,43.55 30.5,28.13 30.25,27.88 U11.3
RESET  (via drill 0.4)
  Top 0.203: R1.1 27.55,81.03 27.3,80.77 27.3,77.19 JP1.5 29,75.5 29,72.5 27.5,71 25,71 24.5,70.5 v24.5,68 | IC1.4 17.1,64.1 v18.5,65.5
  Bottom 0.203: v18.5,65.5 22,65.5 v24.5,68
RESET_IN  (via drill 0.3)
  Top 0.203: v17.75,43.83 v15.7,43.83 9.7,43.83 9.45,43.57 U6.4 | IC1.10 11.95,59.3 11.7,59.05 11.7,55.6 12.3,55 16.4,55 17.9,53.5 20.18,53.5 v20.25,53.42
  Bottom 0.203: v17.75,43.83 17.75,44.6 18.05,44.9 20.05,44.9 20.25,45.1 v20.25,53.42
SCK
  Top 0.203: JP1.3 24.45,74.35 21.3,74.35 20.8,74.85 R5.2 19.85,74.1 19.25,73.5 17,73.5 15.5,72 11.5,72 11,71.5 11,66 12.1,64.9 IC1.3
SS  (via drill 0.3)
  Top 0.203: R4.2 v21.75,76.42 | v21.75,73.5 21.75,71.93 21.5,71.67 20.8,71.67 20.63,71.5 17.5,71.5 16.5,70.5 15.5,70.5 15,70 IC1.44
  Bottom 0.203: v21.75,73.5 v21.75,76.42
SW_MODE
  Top 0.203: 30.25,63.85 30.5,64.1 30.5,92.75 30.25,93 18.75,93 18.5,93.25 18.5,98.55 18.25,98.8 1.25,98.8 1,98.55 1,90.43 SV2.3
  Top 0.254: IC1.26 25.85,60.9 26.2,60.55 26.2,57.1 26.85,56.45 28.5,56.45 30.25,58.2 30.25,63.85
TRIG_OUT  (via drill 0.3)
  Top 0.203: v19.5,50.5 19.5,45.75 19.3,45.15 10.05,45.15 v9.75,45.15 | U6.1 v7.55,40.98 | v19.5,52.75 17.7,52.75 16.15,54.3 12.1,54.3 11.05,55.35 11.05,59.5 11.65,60.1
  Top 0.254: 11.65,60.1 IC1.9
  Bottom 0.203: v19.5,52.75 v19.5,50.5 | v7.55,40.98 7.55,44.94 7.8,45.15 v9.75,45.15
V+  (via drill 0.3, 0.5)
  Top 0.203: v17.07,87.7 U7.5
  Top 0.406: v15.5,18.82 U9.3 15.48,12.98 | 11.28,5.72 11,6 10.95,5.95 C10.+ | 20.73,5.72 D4.K
  Top 0.61: 14,5.72 14.5,5.72 C11.1 20.73,5.72 | 15.48,12.98 14,11.5 14,5.72 | 14,5.72 11.28,5.72
  Bottom 0.406: v15.5,18.82 15.5,20.5 16.5,21.5 16.5,87.12 v17.07,87.7
V-  (via drill 0.3, 0.5)
  Top 0.203: v6.78,82.58 7.28,83.08 R16.1 8.2,81.25 8.45,81 14.25,81 14.5,81.25 14.5,83.25 14.75,83.5 16.8,83.5 17.05,83.75 U7.2
  Top 0.406: C14.2 v2,12.5 | 4.45,9.05 C13.- | 2.8,2 D5.A
  Top 0.61: 4.45,9.05 3.5,10 C14.2 | C13.- 2,6.55 2,2 2.8,2
  Bottom 0.406: v6.78,82.58 1.03,82.58 0.77,82.32 0.75,13.75 v2,12.5

### Text on the board
tDocu: UNI | G8 | EXPAND | STRIPE | POWER | STRIPE